# Altium schematic sheet TSALLED.SchDoc
size A; SheetNumber: 1; SheetTotal: 1
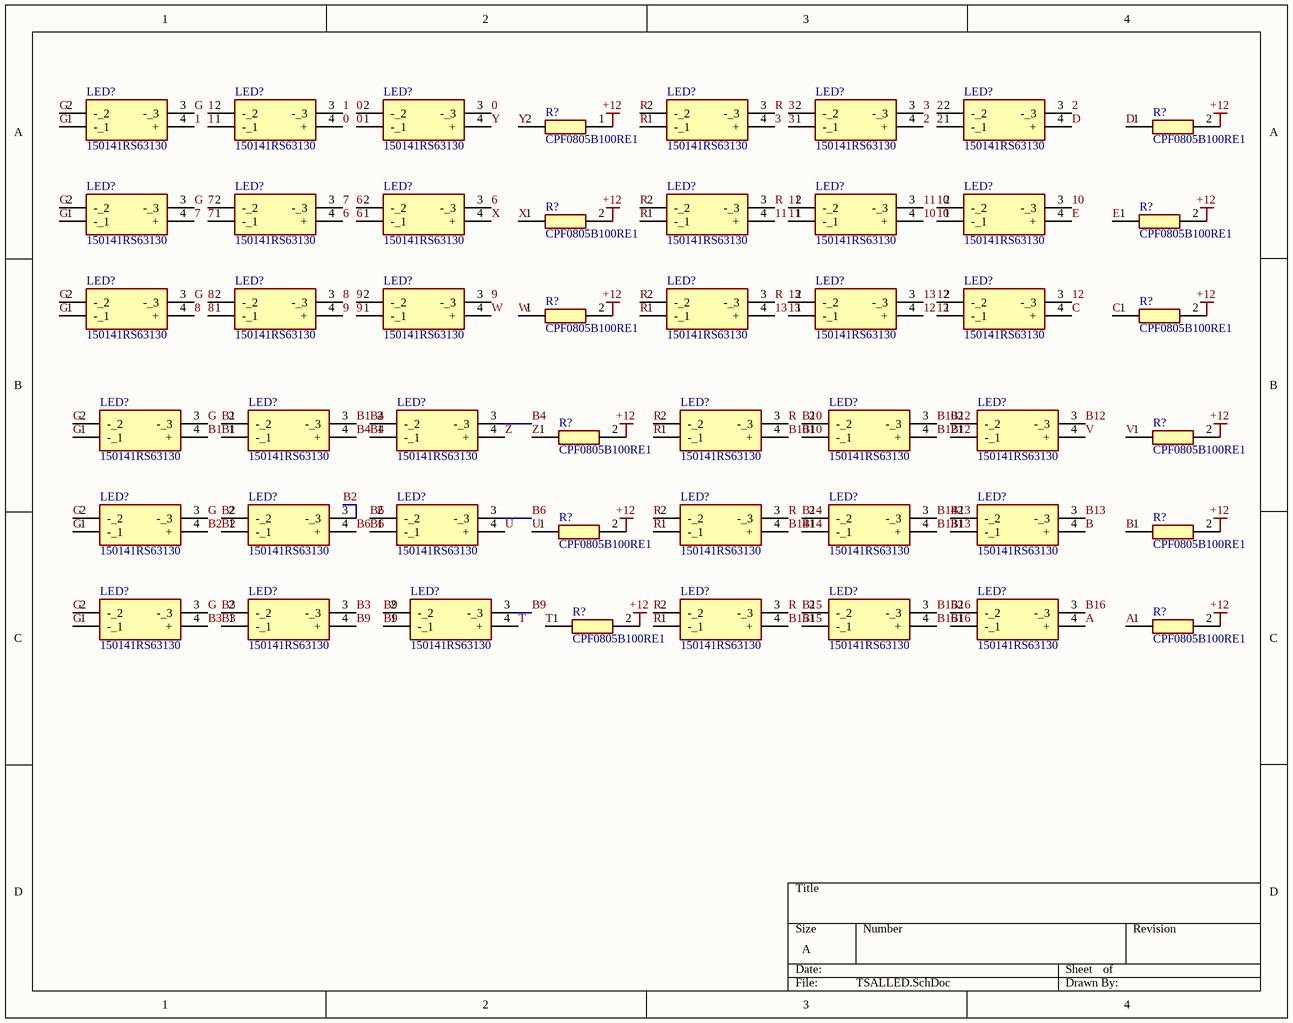
[diagram p0: TSALLED.SchDoc]

## Parts
(Parts that share a designator on the sheet are numbered #1, #2 ... from top to bottom, then left to right.)
LED?#1  150141RS63130  [150141RS63130]
LED?#2  150141RS63130  [150141RS63130]
LED?#3  150141RS63130  [150141RS63130]
LED?#4  150141RS63130  [150141RS63130]
LED?#5  150141RS63130  [150141RS63130]
LED?#6  150141RS63130  [150141RS63130]
LED?#7  150141RS63130  [150141RS63130]
LED?#8  150141RS63130  [150141RS63130]
LED?#9  150141RS63130  [150141RS63130]
LED?#10  150141RS63130  [150141RS63130]
LED?#11  150141RS63130  [150141RS63130]
LED?#12  150141RS63130  [150141RS63130]
LED?#13  150141RS63130  [150141RS63130]
LED?#14  150141RS63130  [150141RS63130]
LED?#15  150141RS63130  [150141RS63130]
LED?#16  150141RS63130  [150141RS63130]
LED?#17  150141RS63130  [150141RS63130]
LED?#18  150141RS63130  [150141RS63130]
LED?#19  150141RS63130  [150141RS63130]
LED?#20  150141RS63130  [150141RS63130]
LED?#21  150141RS63130  [150141RS63130]
LED?#22  150141RS63130  [150141RS63130]
LED?#23  150141RS63130  [150141RS63130]
LED?#24  150141RS63130  [150141RS63130]
LED?#25  150141RS63130  [150141RS63130]
LED?#26  150141RS63130  [150141RS63130]
LED?#27  150141RS63130  [150141RS63130]
LED?#28  150141RS63130  [150141RS63130]
LED?#29  150141RS63130  [150141RS63130]
LED?#30  150141RS63130  [150141RS63130]
LED?#31  150141RS63130  [150141RS63130]
LED?#32  150141RS63130  [150141RS63130]
LED?#33  150141RS63130  [150141RS63130]
LED?#34  150141RS63130  [150141RS63130]
LED?#35  150141RS63130  [150141RS63130]
LED?#36  150141RS63130  [150141RS63130]
R?#1  CPF0805B100RE1  [RESC2012X65N]
R?#2  CPF0805B100RE1  [RESC2012X65N]
R?#3  CPF0805B100RE1  [RESC2012X65N]
R?#4  CPF0805B100RE1  [RESC2012X65N]
R?#5  CPF0805B100RE1  [RESC2012X65N]
R?#6  CPF0805B100RE1  [RESC2012X65N]
R?#7  CPF0805B100RE1  [RESC2012X65N]
R?#8  CPF0805B100RE1  [RESC2012X65N]
R?#9  CPF0805B100RE1  [RESC2012X65N]
R?#10  CPF0805B100RE1  [RESC2012X65N]
R?#11  CPF0805B100RE1  [RESC2012X65N]
R?#12  CPF0805B100RE1  [RESC2012X65N]

## Nets
+12: R?#1.1 R?#2.2 R?#3.2 R?#4.2 R?#5.2 R?#6.2 R?#7.2 R?#8.2 R?#9.2 R?#10.2 R?#11.2 R?#12.2
0: LED?#2.4(+) LED?#3.1(-_1) LED?#3.2(-_2) LED?#3.3(-_3)
1: LED?#1.4(+) LED?#2.1(-_1) LED?#2.2(-_2) LED?#2.3(-_3)
2: LED?#5.4(+) LED?#6.1(-_1) LED?#6.2(-_2) LED?#6.3(-_3)
3: LED?#4.4(+) LED?#5.1(-_1) LED?#5.2(-_2) LED?#5.3(-_3)
6: LED?#8.4(+) LED?#9.1(-_1) LED?#9.2(-_2) LED?#9.3(-_3)
7: LED?#7.4(+) LED?#8.1(-_1) LED?#8.2(-_2) LED?#8.3(-_3)
8: LED?#13.4(+) LED?#14.1(-_1) LED?#14.2(-_2) LED?#14.3(-_3)
9: LED?#14.4(+) LED?#15.1(-_1) LED?#15.2(-_2) LED?#15.3(-_3)
10: LED?#11.4(+) LED?#12.1(-_1) LED?#12.2(-_2) LED?#12.3(-_3)
11: LED?#10.4(+) LED?#11.1(-_1) LED?#11.2(-_2) LED?#11.3(-_3)
12: LED?#17.4(+) LED?#18.1(-_1) LED?#18.2(-_2) LED?#18.3(-_3)
13: LED?#16.4(+) LED?#17.1(-_1) LED?#17.2(-_2) LED?#17.3(-_3)
A: LED?#36.4(+) R?#12.1
B: LED?#30.4(+) R?#10.1
B1: LED?#19.4(+) LED?#20.1(-_1) LED?#20.2(-_2) LED?#20.3(-_3)
B2: LED?#25.4(+) LED?#26.1(-_1) LED?#26.2(-_2) LED?#26.3(-_3)
B3: LED?#31.4(+) LED?#32.1(-_1) LED?#32.2(-_2) LED?#32.3(-_3)
B4: LED?#20.4(+) LED?#21.1(-_1) LED?#21.2(-_2) LED?#21.3(-_3)
B6: LED?#26.4(+) LED?#27.1(-_1) LED?#27.2(-_2) LED?#27.3(-_3)
B9: LED?#32.4(+) LED?#33.1(-_1) LED?#33.2(-_2) LED?#33.3(-_3)
B10: LED?#22.4(+) LED?#23.1(-_1) LED?#23.2(-_2) LED?#23.3(-_3)
B12: LED?#23.4(+) LED?#24.1(-_1) LED?#24.2(-_2) LED?#24.3(-_3)
B13: LED?#29.4(+) LED?#30.1(-_1) LED?#30.2(-_2) LED?#30.3(-_3)
B14: LED?#28.4(+) LED?#29.1(-_1) LED?#29.2(-_2) LED?#29.3(-_3)
B15: LED?#34.4(+) LED?#35.1(-_1) LED?#35.2(-_2) LED?#35.3(-_3)
B16: LED?#35.4(+) LED?#36.1(-_1) LED?#36.2(-_2) LED?#36.3(-_3)
C: LED?#18.4(+) R?#6.1
D: LED?#6.4(+) R?#2.1
E: LED?#12.4(+) R?#4.1
G: LED?#1.1(-_1) LED?#1.2(-_2) LED?#1.3(-_3) LED?#7.1(-_1) LED?#7.2(-_2) LED?#7.3(-_3) LED?#13.1(-_1) LED?#13.2(-_2) LED?#13.3(-_3) LED?#19.1(-_1) LED?#19.2(-_2) LED?#19.3(-_3) LED?#25.1(-_1) LED?#25.2(-_2) LED?#25.3(-_3) LED?#31.1(-_1) LED?#31.2(-_2) LED?#31.3(-_3)
R: LED?#4.1(-_1) LED?#4.2(-_2) LED?#4.3(-_3) LED?#10.1(-_1) LED?#10.2(-_2) LED?#10.3(-_3) LED?#16.1(-_1) LED?#16.2(-_2) LED?#16.3(-_3) LED?#22.1(-_1) LED?#22.2(-_2) LED?#22.3(-_3) LED?#28.1(-_1) LED?#28.2(-_2) LED?#28.3(-_3) LED?#34.1(-_1) LED?#34.2(-_2) LED?#34.3(-_3)
T: LED?#33.4(+) R?#11.1
U: LED?#27.4(+) R?#9.1
V: LED?#24.4(+) R?#8.1
W: LED?#15.4(+) R?#5.1
X: LED?#9.4(+) R?#3.1
Y: LED?#3.4(+) R?#1.2
Z: LED?#21.4(+) R?#7.1

## Library data of the parts
LED?#1-LED?#36 = 150141RS63130: LED; Manufacturer_Name: Wurth Elektronik; Datasheet Link: https://www.we-online.com/components/products/datasheet/150141RS63130.pdf; Height: 3.7mm; Manufacturer_Part_Number: 150141RS63130; Mouser Part Number: 710-150141RS63130; Mouser Price/Stock: https://www.mouser.co.uk/ProductDetail/Wurth-Elektronik/150141RS63130?qs=81r%252BiQLm7BRLV97EClEkBQ%3D%3D
R?#1-R?#12 = CPF0805B100RE1: Resistor; Manufacturer_Name: TE Connectivity; Datasheet Link: https://datasheet.datasheetarchive.com/originals/distributors/DKDS-21/401696.pdf; Height: 0.65mm; Manufacturer_Part_Number: CPF0805B100RE1; Mouser Part Number: 279-CPF0805B100RE1; Mouser Price/Stock: https://www.mouser.co.uk/ProductDetail/TE-Connectivity-Holsworthy/CPF0805B100RE1?qs=9ylKvqdyudkCWLPT1QvLZQ%3D%3D; Arrow Part Number: CPF0805B100RE1; Arrow Price/Stock: https://www.arrow.com/en/products/cpf0805b100re1/te-connectivity?region=nac